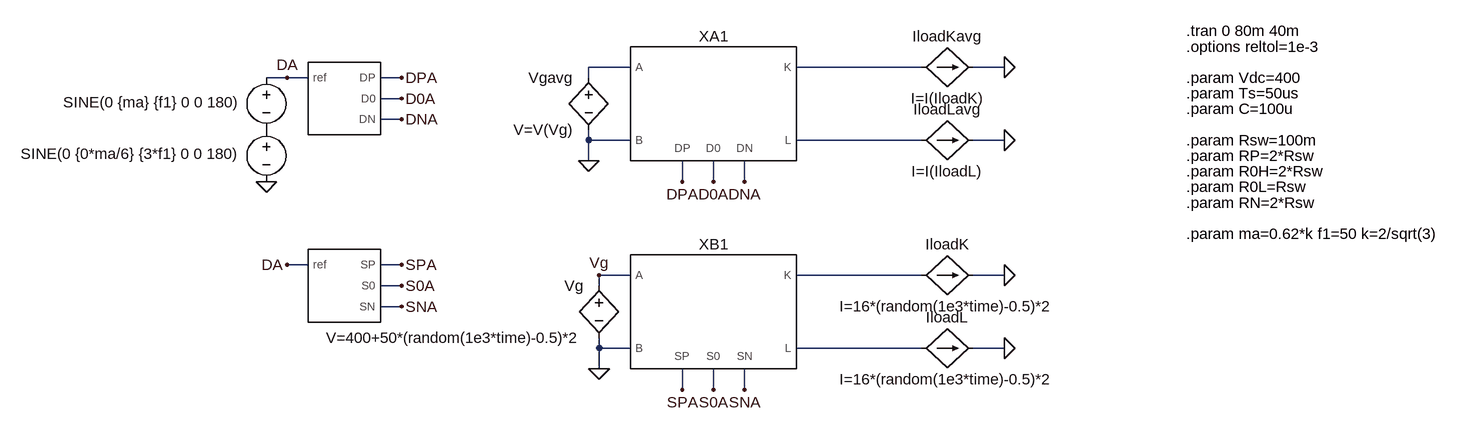
[diagram p0: schematic average_model_validation_noise.asc]
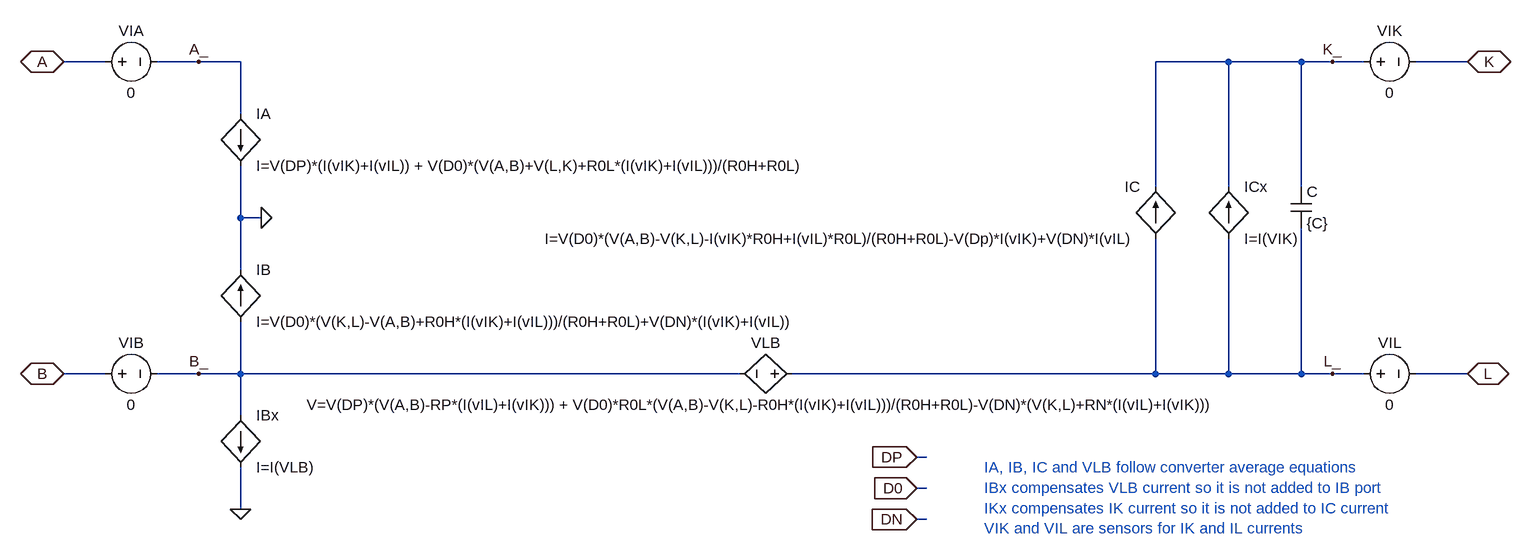
[diagram p1: sub-circuit pn_average_model.asc]
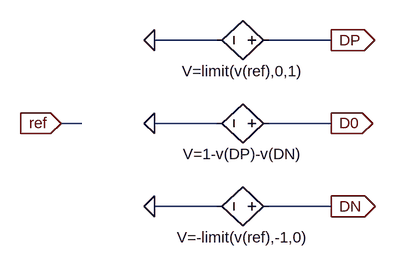
[diagram p2: sub-circuit pn_average_modulator.asc]
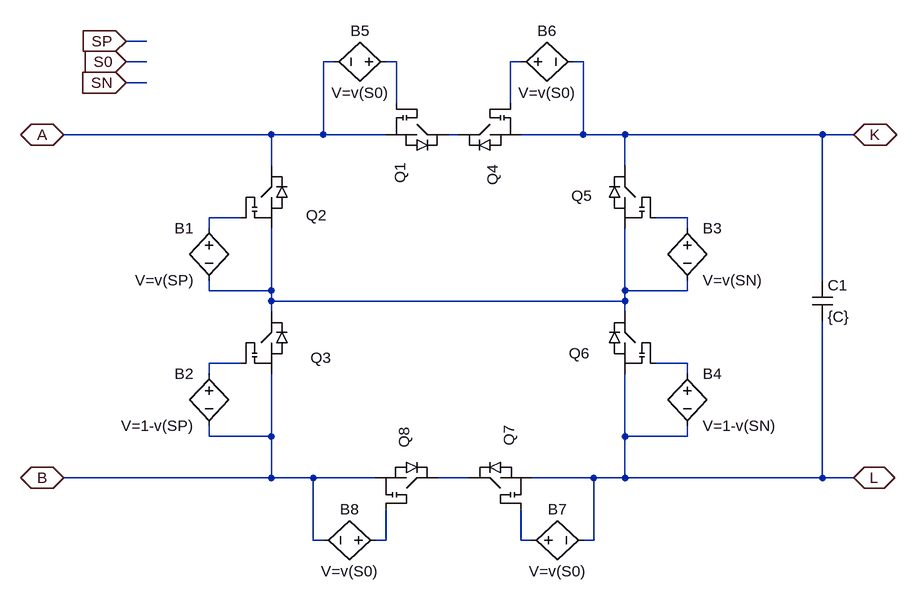
[diagram p3: sub-circuit pn_switching_model.asc]
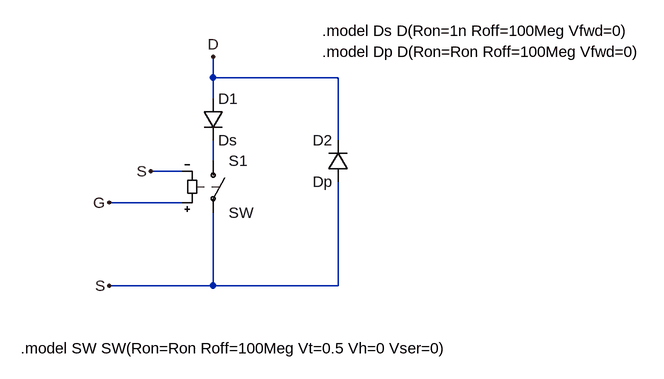
[diagram p4: sub-circuit isw.asc]
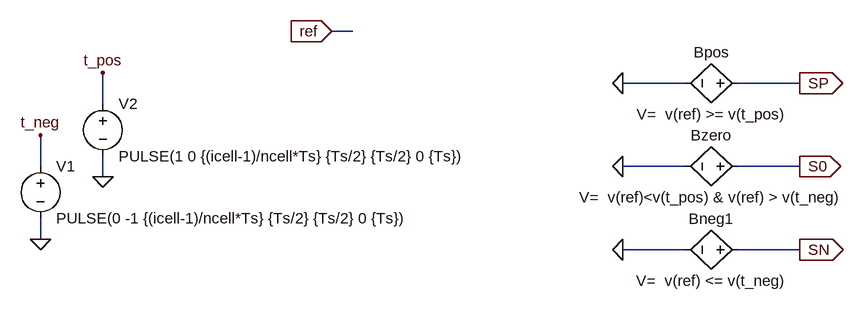
[diagram p5: sub-circuit pn_modulator.asc]
average_model_validation_noise.asc, the LTspice schematic file:
Version 4
SHEET 1 4356 1844
WIRE 2272 -1392 2208 -1392
WIRE 2720 -1392 2528 -1392
WIRE 2848 -1392 2800 -1392
WIRE 1744 -1376 1712 -1376
WIRE 1776 -1376 1744 -1376
WIRE 1920 -1376 1888 -1376
WIRE 2208 -1376 2208 -1392
WIRE 1920 -1344 1888 -1344
WIRE 1920 -1312 1888 -1312
WIRE 2208 -1280 2208 -1296
WIRE 2272 -1280 2208 -1280
WIRE 2720 -1280 2528 -1280
WIRE 2848 -1280 2800 -1280
WIRE 2208 -1248 2208 -1280
WIRE 2352 -1216 2352 -1248
WIRE 2400 -1216 2400 -1248
WIRE 2448 -1216 2448 -1248
WIRE 1776 -1088 1744 -1088
WIRE 1920 -1088 1888 -1088
WIRE 2272 -1072 2224 -1072
WIRE 2720 -1072 2528 -1072
WIRE 2848 -1072 2800 -1072
WIRE 1920 -1056 1888 -1056
WIRE 2224 -1056 2224 -1072
WIRE 1920 -1024 1888 -1024
WIRE 2224 -960 2224 -976
WIRE 2272 -960 2224 -960
WIRE 2720 -960 2528 -960
WIRE 2848 -960 2800 -960
WIRE 2224 -928 2224 -960
WIRE 2352 -896 2352 -928
WIRE 2400 -896 2400 -928
WIRE 2448 -896 2448 -928
FLAG 2352 -1216 DPA
FLAG 2400 -1216 D0A
FLAG 2448 -1216 DNA
FLAG 2208 -1248 0
FLAG 1920 -1376 DPA
FLAG 1920 -1344 D0A
FLAG 1920 -1312 DNA
FLAG 1712 -1216 0
FLAG 1744 -1376 DA
FLAG 1920 -1088 SPA
FLAG 1920 -1056 S0A
FLAG 1920 -1024 SNA
FLAG 1744 -1088 DA
FLAG 2848 -960 0
FLAG 2352 -896 SPA
FLAG 2400 -896 S0A
FLAG 2448 -896 SNA
FLAG 2224 -928 0
FLAG 2848 -1280 0
FLAG 2848 -1072 0
FLAG 2848 -1392 0
FLAG 2224 -1072 Vg
SYMBOL bv 2208 -1392 M0
SYMATTR InstName Vgavg
SYMATTR Value V=V(Vg)
SYMBOL PN_average_model 2400 -1344 R0
SYMATTR InstName XA1
SYMATTR SpiceLine C={C} RP={RP} R0H={R0H} R0L={R0L} RN={RN}
SYMBOL voltage 1712 -1392 M0
WINDOW 0 24 16 Invisible 2
WINDOW 3 39 54 Left 2
SYMATTR InstName V1
SYMATTR Value SINE(0 {ma} {f1} 0 0 180)
SYMBOL voltage 1712 -1312 M0
WINDOW 0 24 16 Invisible 2
WINDOW 3 39 53 Left 2
SYMATTR InstName V7
SYMATTR Value SINE(0 {0*ma/6} {3*f1} 0 0 180)
SYMBOL PN_average_modulator 1824 -1344 R0
WINDOW 0 8 -56 Invisible 2
SYMATTR InstName X2
SYMBOL PN_switching_model 2400 -1024 R0
SYMATTR InstName XB1
SYMBOL PN_modulator 1824 -1056 R0
WINDOW 0 8 -56 Invisible 2
SYMATTR InstName X1
SYMBOL bi 2720 -960 M90
WINDOW 0 -32 40 VBottom 2
WINDOW 3 32 40 VTop 2
SYMATTR InstName IloadL
SYMATTR Value I=16*(random(1e3*time)-0.5)*2
SYMBOL bi 2720 -1280 M90
WINDOW 0 -32 40 VBottom 2
WINDOW 3 32 40 VTop 2
SYMATTR InstName IloadLavg
SYMATTR Value I=I(IloadL)
SYMBOL bi 2720 -1072 M90
WINDOW 0 -32 40 VBottom 2
WINDOW 3 32 40 VTop 2
SYMATTR InstName IloadK
SYMATTR Value I=16*(random(1e3*time)-0.5)*2
SYMBOL bi 2720 -1392 M90
WINDOW 0 -32 40 VBottom 2
WINDOW 3 32 40 VTop 2
SYMATTR InstName IloadKavg
SYMATTR Value I=I(IloadK)
SYMBOL bv 2224 -1072 M0
SYMATTR InstName Vg
SYMATTR Value V=400+50*(random(1e3*time)-0.5)*2
TEXT 3128 -1352 Left 2 !.param Ts=50us
TEXT 3128 -1448 Left 2 !.tran 0 80m 40m
TEXT 3128 -1376 Left 2 !.param Vdc=400
TEXT 3128 -1136 Left 2 !.param ma=0.62*k f1=50 k=2/sqrt(3)
TEXT 3128 -1280 Left 2 !.param Rsw=100m
TEXT 3128 -1256 Left 2 !.param RP=2*Rsw
TEXT 3128 -1184 Left 2 !.param RN=2*Rsw
TEXT 3128 -1232 Left 2 !.param R0H=2*Rsw
TEXT 3128 -1208 Left 2 !.param R0L=Rsw
TEXT 3128 -1328 Left 2 !.param C=100u
TEXT 3128 -1424 Left 2 !.options reltol=1e-3

pn_average_model.asc, the sub-circuit schematic file:
Version 4
SHEET 1 2060 780
WIRE -720 16 -784 16
WIRE -576 16 -640 16
WIRE -512 16 -576 16
WIRE 1008 16 896 16
WIRE 1120 16 1008 16
WIRE 1168 16 1120 16
WIRE 1216 16 1168 16
WIRE 1376 16 1296 16
WIRE -512 96 -512 16
WIRE 896 208 896 16
WIRE 1008 208 1008 16
WIRE 1120 208 1120 16
WIRE -512 256 -512 176
WIRE -480 256 -512 256
WIRE -512 336 -512 256
WIRE -720 496 -784 496
WIRE -576 496 -640 496
WIRE -512 496 -512 416
WIRE -512 496 -576 496
WIRE 256 496 -512 496
WIRE 896 496 896 288
WIRE 896 496 336 496
WIRE 1008 496 1008 288
WIRE 1008 496 896 496
WIRE 1120 496 1120 272
WIRE 1120 496 1008 496
WIRE 1168 496 1120 496
WIRE 1216 496 1168 496
WIRE 1376 496 1296 496
WIRE -512 560 -512 496
WIRE 544 624 528 624
WIRE 544 672 528 672
WIRE -512 704 -512 640
WIRE 544 720 528 720
FLAG 1376 16 K
IOPIN 1376 16 BiDir
FLAG 1376 496 L
IOPIN 1376 496 BiDir
FLAG -784 16 A
IOPIN -784 16 BiDir
FLAG -784 496 B
IOPIN -784 496 BiDir
FLAG 528 624 DP
IOPIN 528 624 In
FLAG 528 672 D0
IOPIN 528 672 In
FLAG 528 720 DN
IOPIN 528 720 In
FLAG -480 256 0
FLAG -512 704 0
FLAG -576 16 A_
FLAG -576 496 B_
FLAG 1168 16 K_
FLAG 1168 496 L_
SYMBOL bv 352 496 R90
WINDOW 0 -32 56 VBottom 2
WINDOW 3 32 56 VTop 2
SYMATTR InstName VLB
SYMATTR Value V=V(DP)*(V(A,B)-RP*(I(vIL)+I(vIK))) + V(D0)*R0L*(V(A,B)-V(K,L)-R0H*(I(vIK)+I(vIL)))/(R0H+R0L)-V(DN)*(V(K,L)+RN*(I(vIL)+I(vIK)))
SYMBOL bi -512 96 R0
SYMATTR InstName IA
SYMATTR Value I=V(DP)*(I(vIK)+I(vIL)) + V(D0)*(V(A,B)+V(L,K)+R0L*(I(vIK)+I(vIL)))/(R0H+R0L)
SYMBOL cap 1104 208 R0
SYMATTR InstName C
SYMATTR Value {C}
SYMBOL bi 896 288 R180
WINDOW 0 24 80 Left 2
WINDOW 3 24 0 Left 2
SYMATTR InstName IC
SYMATTR Value I=V(D0)*(V(A,B)-V(K,L)-I(vIK)*R0H+I(vIL)*R0L)/(R0H+R0L)-V(Dp)*I(vIK)+V(DN)*I(vIL)
SYMBOL bi -512 416 M180
WINDOW 0 24 80 Left 2
WINDOW 3 24 0 Left 2
SYMATTR InstName IB
SYMATTR Value I=V(D0)*(V(K,L)-V(A,B)+R0H*(I(vIK)+I(vIL)))/(R0H+R0L)+V(DN)*(I(vIK)+I(vIL))
SYMBOL voltage 1200 496 R270
WINDOW 0 32 56 VTop 2
WINDOW 3 -32 56 VBottom 2
SYMATTR InstName VIL
SYMATTR Value 0
SYMBOL voltage 1200 16 R270
WINDOW 0 32 56 VTop 2
WINDOW 3 -32 56 VBottom 2
SYMATTR InstName VIK
SYMATTR Value 0
SYMBOL bi -512 560 R0
SYMATTR InstName IBx
SYMATTR Value I=I(VLB)
SYMBOL bi 1008 288 M180
WINDOW 0 24 80 Left 2
WINDOW 3 24 0 Left 2
SYMATTR InstName ICx
SYMATTR Value I=I(VIK)
SYMBOL voltage -736 496 R270
WINDOW 0 32 56 VTop 2
WINDOW 3 -32 56 VBottom 2
SYMATTR InstName VIB
SYMATTR Value 0
SYMBOL voltage -736 16 R270
WINDOW 0 32 56 VTop 2
WINDOW 3 -32 56 VBottom 2
SYMATTR InstName VIA
SYMATTR Value 0
TEXT 632 640 Left 2 ;IA, IB, IC and VLB follow converter average equations\nIBx compensates VLB current so it is not added to IB port\nIKx compensates IK current so it is not added to IC current\nVIK and VIL are sensors for IK and IL currents

pn_average_modulator.asc, the sub-circuit schematic file:
Version 4
SHEET 1 880 680
WIRE 304 160 208 160
WIRE 480 160 384 160
WIRE 96 288 64 288
WIRE 304 288 208 288
WIRE 480 288 384 288
WIRE 304 416 208 416
WIRE 480 416 384 416
FLAG 208 160 0
FLAG 208 288 0
FLAG 208 416 0
FLAG 480 160 DP
IOPIN 480 160 Out
FLAG 480 288 D0
IOPIN 480 288 Out
FLAG 480 416 DN
IOPIN 480 416 Out
FLAG 64 288 ref
IOPIN 64 288 In
SYMBOL bv 400 160 R90
WINDOW 0 -32 56 Invisible 2
WINDOW 3 32 56 VTop 2
SYMATTR InstName Bpos1
SYMATTR Value V=limit(v(ref),0,1)
SYMBOL bv 400 288 R90
WINDOW 0 -32 56 Invisible 2
WINDOW 3 32 56 VTop 2
SYMATTR InstName Bzero1
SYMATTR Value V=1-v(DP)-v(DN)
SYMBOL bv 400 416 R90
WINDOW 0 -32 56 Invisible 2
WINDOW 3 32 56 VTop 2
SYMATTR InstName Bneg1
SYMATTR Value V=-limit(v(ref),-1,0)

pn_switching_model.asc, the sub-circuit schematic file:
Version 4
SHEET 1 1104 712
WIRE -48 -112 -80 -112
WIRE -48 -80 -80 -80
WIRE 240 -80 224 -80
WIRE 336 -80 320 -80
WIRE 528 -80 512 -80
WIRE 624 -80 608 -80
WIRE -48 -48 -80 -48
WIRE 336 -16 336 -80
WIRE 512 -16 512 -80
WIRE 144 32 -176 32
WIRE 224 32 224 -80
WIRE 224 32 144 32
WIRE 320 32 224 32
WIRE 432 32 416 32
WIRE 624 32 624 -80
WIRE 624 32 528 32
WIRE 688 32 624 32
WIRE 992 32 688 32
WIRE 1040 32 992 32
WIRE 144 80 144 32
WIRE 688 80 688 32
WIRE 96 160 48 160
WIRE 784 160 736 160
WIRE 48 176 48 160
WIRE 784 176 784 160
WIRE 992 256 992 32
WIRE 48 272 48 256
WIRE 144 272 144 176
WIRE 144 272 48 272
WIRE 688 272 688 176
WIRE 784 272 784 256
WIRE 784 272 688 272
WIRE 144 288 144 272
WIRE 688 288 688 272
WIRE 688 288 144 288
WIRE 144 304 144 288
WIRE 688 304 688 288
WIRE 96 384 48 384
WIRE 784 384 736 384
WIRE 48 400 48 384
WIRE 784 400 784 384
WIRE 48 496 48 480
WIRE 144 496 144 400
WIRE 144 496 48 496
WIRE 688 496 688 400
WIRE 784 496 784 480
WIRE 784 496 688 496
WIRE 144 560 144 496
WIRE 144 560 -176 560
WIRE 208 560 144 560
WIRE 304 560 208 560
WIRE 448 560 400 560
WIRE 640 560 544 560
WIRE 688 560 688 496
WIRE 688 560 640 560
WIRE 992 560 992 320
WIRE 992 560 688 560
WIRE 1040 560 992 560
WIRE 208 656 208 560
WIRE 224 656 208 656
WIRE 320 656 320 608
WIRE 320 656 304 656
WIRE 528 656 528 608
WIRE 544 656 528 656
WIRE 640 656 640 560
WIRE 640 656 624 656
FLAG 1040 32 K
IOPIN 1040 32 BiDir
FLAG 1040 560 L
IOPIN 1040 560 BiDir
FLAG -176 32 A
IOPIN -176 32 BiDir
FLAG -176 560 B
IOPIN -176 560 BiDir
FLAG -80 -112 SP
IOPIN -80 -112 In
FLAG -80 -80 S0
IOPIN -80 -80 In
FLAG -80 -48 SN
IOPIN -80 -48 In
SYMBOL bv 48 160 M0
SYMATTR InstName B1
SYMATTR Value V=v(SP)
SYMBOL bv 48 384 M0
SYMATTR InstName B2
SYMATTR Value V=1-v(SP)
SYMBOL bv 784 160 R0
SYMATTR InstName B3
SYMATTR Value V=v(SN)
SYMBOL bv 784 384 R0
SYMATTR InstName B4
SYMATTR Value V=1-v(SN)
SYMBOL bv 336 -80 R90
WINDOW 0 -32 56 VBottom 2
WINDOW 3 32 56 VTop 2
SYMATTR InstName B5
SYMATTR Value V=v(S0)
SYMBOL bv 512 -80 M90
WINDOW 0 -32 56 VBottom 2
WINDOW 3 32 56 VTop 2
SYMATTR InstName B6
SYMATTR Value V=v(S0)
SYMBOL iSW 352 32 R90
WINDOW 0 43 10 Left 2
SYMATTR InstName Q1
SYMATTR SpiceLine Ron=Rswitch
SYMBOL iSW 144 144 R0
WINDOW 0 53 12 Left 2
SYMATTR InstName Q2
SYMATTR SpiceLine Ron=Rswitch
SYMBOL iSW 144 368 R0
WINDOW 0 60 7 Left 2
SYMATTR InstName Q3
SYMATTR SpiceLine Ron=Rswitch
SYMBOL iSW 496 32 M90
WINDOW 0 46 -12 Left 2
SYMATTR InstName Q4
SYMATTR SpiceLine Ron=Rswitch
SYMBOL iSW 688 144 M0
WINDOW 0 50 -18 Left 2
SYMATTR InstName Q5
SYMATTR SpiceLine Ron=Rswitch
SYMBOL iSW 688 368 M0
WINDOW 0 54 0 Left 2
SYMATTR InstName Q6
SYMATTR SpiceLine Ron=Rswitch
SYMBOL cap 976 256 R0
SYMATTR InstName C1
SYMATTR Value {C}
SYMBOL bv 528 656 R270
WINDOW 0 32 56 VTop 2
WINDOW 3 -32 56 VBottom 2
SYMATTR InstName B7
SYMATTR Value V=v(S0)
SYMBOL bv 320 656 M270
WINDOW 0 32 56 VTop 2
WINDOW 3 -32 56 VBottom 2
SYMATTR InstName B8
SYMATTR Value V=v(S0)
SYMBOL iSW 512 560 R270
WINDOW 0 49 -2 Left 2
SYMATTR InstName Q7
SYMATTR SpiceLine Ron=Rswitch
SYMBOL iSW 336 560 M270
WINDOW 0 46 -12 Left 2
SYMATTR InstName Q8
SYMATTR SpiceLine Ron=Rswitch

isw.asc, the sub-circuit schematic file:
Version 4
SHEET 1 880 680
WIRE 160 -32 160 -64
WIRE 352 -32 160 -32
WIRE 160 0 160 -32
WIRE 352 64 352 -32
WIRE 160 96 160 64
WIRE 112 112 64 112
WIRE 112 160 0 160
WIRE 160 288 0 288
WIRE 160 288 160 176
WIRE 352 288 352 128
WIRE 352 288 160 288
FLAG 0 160 G
FLAG 0 288 S
FLAG 160 -64 D
FLAG 64 112 S
SYMBOL sw 160 80 R0
SYMATTR InstName S1
SYMBOL diode 144 0 R0
SYMATTR InstName D1
SYMATTR Value Ds
SYMBOL diode 368 128 R180
WINDOW 0 24 64 Left 2
WINDOW 3 24 0 Left 2
SYMATTR InstName D2
SYMATTR Value Dp
TEXT -136 384 Left 2 !.model SW SW(Ron=Ron Roff=100Meg Vt=0.5 Vh=0 Vser=0)
TEXT 328 -104 Left 2 !.model Ds D(Ron=1n Roff=100Meg Vfwd=0)
TEXT 328 -72 Left 2 !.model Dp D(Ron=Ron Roff=100Meg Vfwd=0)

pn_modulator.asc, the sub-circuit schematic file:
Version 4
SHEET 1 1100 680
WIRE 304 160 272 160
WIRE 816 240 720 240
WIRE 992 240 896 240
WIRE -80 272 -80 224
WIRE -176 368 -176 320
WIRE 816 368 720 368
WIRE 992 368 896 368
WIRE -80 384 -80 352
WIRE -176 480 -176 448
WIRE 816 496 720 496
WIRE 992 496 896 496
FLAG -176 480 0
FLAG -176 320 t_neg
FLAG -80 384 0
FLAG -80 224 t_pos
FLAG 720 240 0
FLAG 720 368 0
FLAG 720 496 0
FLAG 992 240 SP
IOPIN 992 240 Out
FLAG 992 368 S0
IOPIN 992 368 Out
FLAG 992 496 SN
IOPIN 992 496 Out
FLAG 272 160 ref
IOPIN 272 160 In
SYMBOL voltage -176 352 R0
WINDOW 123 0 0 Left 2
WINDOW 39 0 0 Left 2
SYMATTR InstName V1
SYMATTR Value PULSE(0 -1 {(icell-1)/ncell*Ts} {Ts/2} {Ts/2} 0 {Ts})
SYMBOL voltage -80 256 R0
WINDOW 123 0 0 Left 2
WINDOW 39 0 0 Left 2
SYMATTR InstName V2
SYMATTR Value PULSE(1 0 {(icell-1)/ncell*Ts} {Ts/2} {Ts/2} 0 {Ts})
SYMBOL bv 912 240 R90
WINDOW 0 -32 56 VBottom 2
WINDOW 3 32 56 VTop 2
SYMATTR InstName Bpos
SYMATTR Value V=  v(ref) >= v(t_pos)
SYMBOL bv 912 368 R90
WINDOW 0 -32 56 VBottom 2
WINDOW 3 32 56 VTop 2
SYMATTR InstName Bzero
SYMATTR Value V=  v(ref)<v(t_pos) & v(ref) > v(t_neg)
SYMBOL bv 912 496 R90
WINDOW 0 -32 56 VBottom 2
WINDOW 3 32 56 VTop 2
SYMATTR InstName Bneg1
SYMATTR Value V=  v(ref) <= v(t_neg)

The netlist it stands for:
* average_model_validation_noise.asc
B§Vgavg N001 0 V=V(Vg)
XXA1 D0A DNA DPA N001 0 N002 N003 pn_average_model params: C={C} RP={RP} R0H={R0H} R0L={R0L} RN={RN}
V1 DA P001 SINE(0 {ma} {f1} 0 0 180)
V7 P001 0 SINE(0 {0*ma/6} {3*f1} 0 0 180)
XX2 DA D0A DNA DPA pn_average_modulator
XXB1 S0A SNA SPA Vg 0 N004 N005 pn_switching_model params: C=100u
XX1 DA S0A SNA SPA pn_modulator params: Ts = {Ts} iCell=1 nCell=1
B§IloadL N005 0 I=16*(random(1e3*time)-0.5)*2
B§IloadLavg N003 0 I=I(IloadL)
B§IloadK N004 0 I=16*(random(1e3*time)-0.5)*2
B§IloadKavg N002 0 I=I(IloadK)
B§Vg Vg 0 V=400+50*(random(1e3*time)-0.5)*2

* block symbol definitions
.subckt pn_average_model D0 DN DP A B K L
B§VLB L_ B_ V=V(DP)*(V(A,B)-RP*(I(vIL)+I(vIK))) + V(D0)*R0L*(V(A,B)-V(K,L)-R0H*(I(vIK)+I(vIL)))/(R0H+R0L)-V(DN)*(V(K,L)+RN*(I(vIL)+I(vIK)))
B§IA A_ 0 I=V(DP)*(I(vIK)+I(vIL)) + V(D0)*(V(A,B)+V(L,K)+R0L*(I(vIK)+I(vIL)))/(R0H+R0L)
C K_ L_ {C}
B§IC L_ K_ I=V(D0)*(V(A,B)-V(K,L)-I(vIK)*R0H+I(vIL)*R0L)/(R0H+R0L)-V(Dp)*I(vIK)+V(DN)*I(vIL)
B§IB B_ 0 I=V(D0)*(V(K,L)-V(A,B)+R0H*(I(vIK)+I(vIL)))/(R0H+R0L)+V(DN)*(I(vIK)+I(vIL))
VIL L_ L 0
VIK K_ K 0
B§IBx B_ 0 I=I(VLB)
B§ICx L_ K_ I=I(VIK)
VIB B B_ 0
VIA A A_ 0
* IA, IB, IC and VLB follow converter average equations
* IBx compensates VLB current so it is not added to IB port
* IKx compensates IK current so it is not added to IC current
* VIK and VIL are sensors for IK and IL currents
.ends pn_average_model

.subckt pn_average_modulator ref D0 DN DP
Bpos1 DP 0 V=limit(v(ref),0,1)
Bzero1 D0 0 V=1-v(DP)-v(DN)
Bneg1 DN 0 V=-limit(v(ref),-1,0)
.ends pn_average_modulator

.subckt pn_switching_model S0 SN SP A B K L
B1 N004 N006 V=v(SP)
B2 N007 B V=1-v(SP)
B3 N005 N006 V=v(SN)
B4 N008 L V=1-v(SN)
B5 N001 A V=v(S0)
B6 N002 K V=v(S0)
XQ1 N003 A N001 isw params: Ron=Rswitch
XQ2 A N006 N004 isw params: Ron=Rswitch
XQ3 N006 B N007 isw params: Ron=Rswitch
XQ4 N003 K N002 isw params: Ron=Rswitch
XQ5 K N006 N005 isw params: Ron=Rswitch
XQ6 N006 L N008 isw params: Ron=Rswitch
C1 K L {C}
B7 N011 L V=v(S0)
B8 N010 B V=v(S0)
XQ7 N009 L N011 isw params: Ron=Rswitch
XQ8 N009 B N010 isw params: Ron=Rswitch
.ends pn_switching_model

.subckt isw D S G
S1 N001 S G S SW
D1 D N001 Ds
D2 S D Dp
.model SW SW(Ron=Ron Roff=100Meg Vt=0.5 Vh=0 Vser=0)
.model Ds D(Ron=1n Roff=100Meg Vfwd=0)
.model Dp D(Ron=Ron Roff=100Meg Vfwd=0)
.ends isw

.subckt pn_modulator ref S0 SN SP
V1 t_neg 0 PULSE(0 -1 {(icell-1)/ncell*Ts} {Ts/2} {Ts/2} 0 {Ts})
V2 t_pos 0 PULSE(1 0 {(icell-1)/ncell*Ts} {Ts/2} {Ts/2} 0 {Ts})
Bpos SP 0 V=  v(ref) >= v(t_pos)
Bzero S0 0 V=  v(ref)<v(t_pos) & v(ref) > v(t_neg)
Bneg1 SN 0 V=  v(ref) <= v(t_neg)
.ends pn_modulator

.model D D
.lib standard.dio
.param Ts=50us
.tran 0 80m 40m
.param Vdc=400
.param ma=0.62*k f1=50 k=2/sqrt(3)
.param Rsw=100m
.param RP=2*Rsw
.param RN=2*Rsw
.param R0H=2*Rsw
.param R0L=Rsw
.param C=100u
.options reltol=1e-3
.backanno
.end